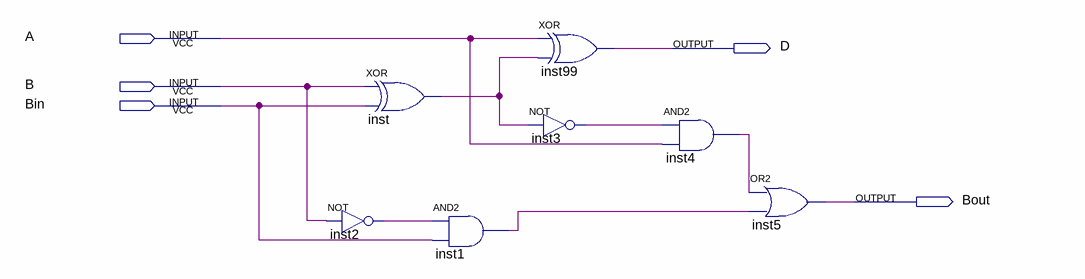
[diagram p0: schematic sheet]
// Quartus schematic Sub1bits.bdf as structural Verilog: 7 symbols, 5 pins
module Sub1bits (
  input  A,
  input  B,
  input  Bin,
  output D,
  output Bout
);

  wire inst1_out, inst2_out, inst3_out, inst4_out, inst_out;

  xor inst (inst_out, B, Bin);
  not inst2 (inst2_out, B);
  and inst1 (inst1_out, inst2_out, Bin);
  xor inst99 (D, A, inst_out);
  not inst3 (inst3_out, inst_out);
  and inst4 (inst4_out, inst3_out, A);
  or inst5 (Bout, inst4_out, inst1_out);
endmodule
